# Altium schematic sheet Slave2_flying_pcb_v1.SchDoc
size A4
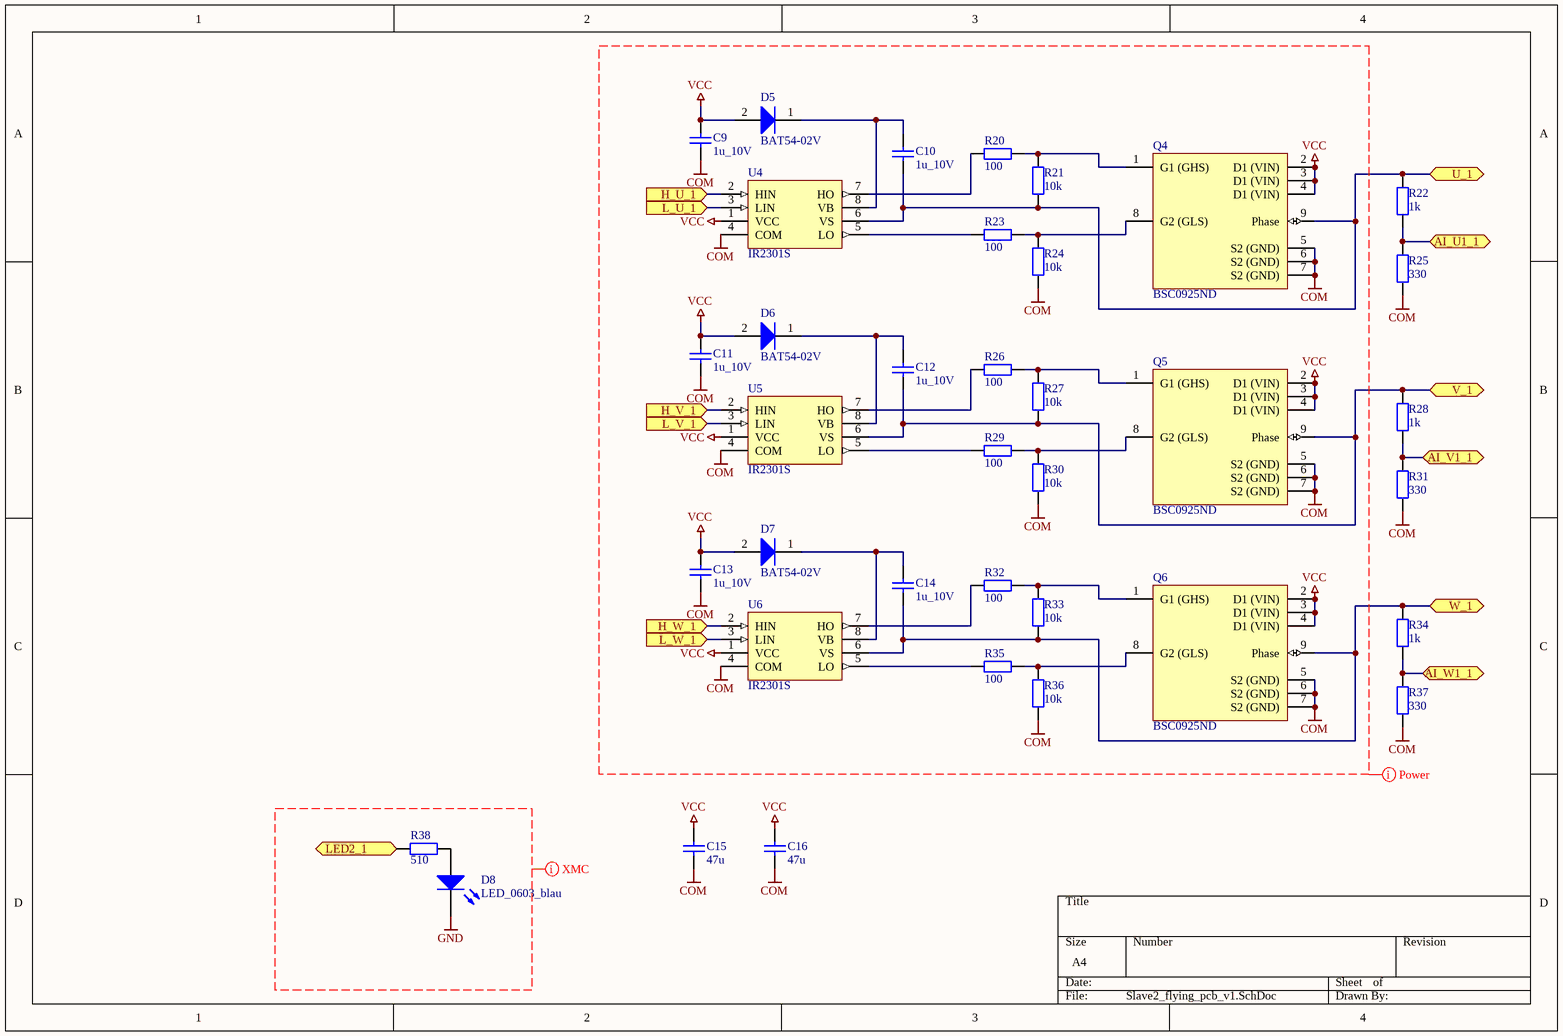
[diagram p0: Slave2_flying_pcb_v1.SchDoc]

## Parts
C9  1u_10V  [1608[0603]]
C10  1u_10V  [1608[0603]]
C11  1u_10V  [1608[0603]]
C12  1u_10V  [1608[0603]]
C13  1u_10V  [1608[0603]]
C14  1u_10V  [1608[0603]]
C15  47u  [_0805]
C16  47u  [_0805]
D5  BAT54-02V  [INF-SC79_V]
D6  BAT54-02V  [INF-SC79_V]
D7  BAT54-02V  [INF-SC79_V]
D8  LED_0603_blau  [LED_0603]
Q4  BSC0925ND  [INF-PG-TISON-8_V]
Q5  BSC0925ND  [INF-PG-TISON-8_V]
Q6  BSC0925ND  [INF-PG-TISON-8_V]
R20  value 100  [1608[0603]]  (hidden comment: Res_0603)
R21  value 10k  [1608[0603]]  (hidden comment: Res_0603)
R22  value 1k  [1608[0603]]  (hidden comment: Res_0603)
R23  value 100  [1608[0603]]  (hidden comment: Res_0603)
R24  value 10k  [1608[0603]]  (hidden comment: Res_0603)
R25  value 330  [1608[0603]]  (hidden comment: Res_0603)
R26  value 100  [1608[0603]]  (hidden comment: Res_0603)
R27  value 10k  [1608[0603]]  (hidden comment: Res_0603)
R28  value 1k  [1608[0603]]  (hidden comment: Res_0603)
R29  value 100  [1608[0603]]  (hidden comment: Res_0603)
R30  value 10k  [1608[0603]]  (hidden comment: Res_0603)
R31  value 330  [1608[0603]]  (hidden comment: Res_0603)
R32  value 100  [1608[0603]]  (hidden comment: Res_0603)
R33  value 10k  [1608[0603]]  (hidden comment: Res_0603)
R34  value 1k  [1608[0603]]  (hidden comment: Res_0603)
R35  value 100  [1608[0603]]  (hidden comment: Res_0603)
R36  value 10k  [1608[0603]]  (hidden comment: Res_0603)
R37  value 330  [1608[0603]]  (hidden comment: Res_0603)
R38  value 510  [1608[0603]]  (hidden comment: Res_0603)
U4  IR2301S  [SO-8_N]
U5  IR2301S  [SO-8_N]
U6  IR2301S  [SO-8_N]

## Ports
AI_U1_1 (bidir), AI_V1_1 (bidir), AI_W1_1 (bidir), H_U_1, H_V_1, H_W_1, L_U_1, L_V_1, L_W_1, LED2_1, U_1 (bidir), V_1 (bidir), W_1 (bidir)

## Nets
COM: C9.2 C11.2 C13.2 C15.1 C16.1 Q4.5(S2_(GND)) Q4.6(S2_(GND)) Q4.7(S2_(GND)) Q5.5(S2_(GND)) Q5.6(S2_(GND)) Q5.7(S2_(GND)) Q6.5(S2_(GND)) Q6.6(S2_(GND)) Q6.7(S2_(GND)) R24.2 R25.2 R30.2 R31.2 R36.2 R37.2 U4.4(COM) U5.4(COM) U6.4(COM)
GND: D8.2
VCC: C9.1 C11.1 C13.1 C15.2 C16.2 D5.2(A) D6.2(A) D7.2(A) Q4.2(D1_(VIN)) Q4.3(D1_(VIN)) Q4.4(D1_(VIN)) Q5.2(D1_(VIN)) Q5.3(D1_(VIN)) Q5.4(D1_(VIN)) Q6.2(D1_(VIN)) Q6.3(D1_(VIN)) Q6.4(D1_(VIN)) U4.1(VCC) U5.1(VCC) U6.1(VCC)
AI_U1_1: R22.2 R25.1 ; port AI_U1_1
AI_V1_1: R28.2 R31.1 ; port AI_V1_1
AI_W1_1: R34.2 R37.1 ; port AI_W1_1
H_U_1: U4.2(HIN) ; port H_U_1
H_V_1: U5.2(HIN) ; port H_V_1
H_W_1: U6.2(HIN) ; port H_W_1
L_U_1: U4.3(LIN) ; port L_U_1
L_V_1: U5.3(LIN) ; port L_V_1
L_W_1: U6.3(LIN) ; port L_W_1
LED2_1: R38.1 ; port LED2_1
U_1: C10.2 Q4.9(Phase) R21.2 R22.1 U4.6(VS) ; port U_1
V_1: C12.2 Q5.9(Phase) R27.2 R28.1 U5.6(VS) ; port V_1
W_1: C14.2 Q6.9(Phase) R33.2 R34.1 U6.6(VS) ; port W_1
NetC10_1: C10.1 D5.1(K) U4.8(VB)
NetC12_1: C12.1 D6.1(K) U5.8(VB)
NetC14_1: C14.1 D7.1(K) U6.8(VB)
NetD8_1: D8.1 R38.2
NetQ4_1: Q4.1(G1_(GHS)) R20.1 R21.1
NetQ4_8: Q4.8(G2_(GLS)) R23.1 R24.1
NetQ5_1: Q5.1(G1_(GHS)) R26.1 R27.1
NetQ5_8: Q5.8(G2_(GLS)) R29.1 R30.1
NetQ6_1: Q6.1(G1_(GHS)) R32.1 R33.1
NetQ6_8: Q6.8(G2_(GLS)) R35.1 R36.1
NetR20_2: R20.2 U4.7(HO)
NetR23_2: R23.2 U4.5(LO)
NetR26_2: R26.2 U5.7(HO)
NetR29_2: R29.2 U5.5(LO)
NetR32_2: R32.2 U6.7(HO)
NetR35_2: R35.2 U6.5(LO)

## Layout directives
net class Power: COM, VCC
net class XMC: GND

## Library data of the parts
C9-C14 = Cap_133: RS_number: 788-2884; QR: 0; Capacity: 1u; Voltage: 10V; UID: Cap_133; Name: 1u_10V; Name_Hyperlink: http://at.rs-online.com/web/p/keramik-multilayer-kondensatoren/7882884; ComponentLink1URL: #NAME?; mounting: SMD
C15 C16 = Cap_133: Name: Cap_cer_1u_50V; Capacity: 1u; Voltage: 50V; RS_number: 723-6350; QR: 0; UID: Cap_133; ComponentLink1URL: #NAME?; mounting: SMD; Name_Hyperlink: http://at.rs-online.com/web/p/keramik-multilayer-kondensatoren/7236350/
D5-D7 = BAT54-02V: Silicon Schottky Diode, SC79, Reel, Green; Manufacturer: Infineon; Green: TRUE; PackageReference: SC79; PackageDescription: 2-Pin Semiconductor Package, 0.8 x 1.2 mm Body; Supplier 1: Mouser; Supplier Part Number 1: N/A; Halogen-free: FALSE; Mounting Technology: Surface Mount; PartNumber: BAT54-02V; ComponentLink1Description: Manufacturer URL; ComponentLink1URL: http://www.infineon.com/; ComponentLink2Description: Datasheet; ComponentLink2URL: http://www.infineon.com/dgdl/bat54series.pdf?folderId=db3a30431400ef68011425f1ca2505e3&fileId=db3a304314dca3890115190b74210ea6; ComponentLink3Description: Package Specification; ComponentLink3URL: http://www.infineon.com/dgdl/SC79-Package_Overview.pdf?folderId=db3a30431936bc4b011951fbddb03b15&fileId=db3a30431936bc4b01195226fe583b41
D8 = DIODE_60: Type: LED; Colour: blau; RS_number: 697-3610P; QR: 0; UID: DIODE_60; Name: LED_0603_blau; Name_Hyperlink: http://at.rs-online.com/web/p/products/6973610P/; ComponentLink1URL: #WERT!; mounting: SMD
Q4-Q6 = BSC0925ND: N-Channel OptiMOS Power-MOSFET, 30 V VDS, 40 A ID, -55 to 150 degC, PG-TISON-8, Reel, Green; Manufacturer: Infineon; Green: TRUE; ID (max): 40 A; IDpuls (max): 160 A; Polarity: N; Ptot (max): 30 W; QG: 6.7 nC; RDS (on) (max): 5 mOhm; RDS (on) (max) (@4.5V): 7 mOhm; Rth: 4.2 K/W; RthJA (max): 125 K/W; VDS (max): 30 V; VGS(th) (max): 2 V; VGS(th) (min): 1.2 V; DatasheetVersion: Rev. 1.0; PackageVersion: Rev. 01, 09/2011; PackageReference: PG-TISON-8; PackageDescription: 8-Pin Plastic (Green) Small Outline Non-Leaded Package, 5 x 6 mm Body, 1.27 mm Pitch; Halogen-free: TRUE; Packing: Reel; RthJC (max): 4.2 K/W; Mounting Technology: Surface Mount; PartNumber: BSC0925ND; ComponentLink1Description: Manufacturer URL; ComponentLink1URL: http://www.infineon.com/; ComponentLink2Description: Datasheet; ComponentLink2URL: http://www.infineon.com/dgdl/BSC0925ND_rev1+0.pdf?folderId=db3a304313b8b5a60113cee8763b02d7&fileId=db3a304336ca04c90136cec562a24914; ComponentLink3Description: Package Specification; ComponentLink3URL: http://www.infineon.com/dgdl/BSC0910NDI_Rev. 0.5.pdf?folderId=db3a304313b8b5a60113cee8763b02d7&fileId=db3a304336ca04c90136cedc08b64926
R20-R38 = Res_6: UID: Res_6; Name: Res_0603; ComponentLink1URL: #NAME?; mounting: SMD
U4-U6 = IR2101S: High and Low Side Driver; Published: 8-Jun-2000; LatestRevisionDate: 13-Apr-2006; LatestRevisionNote: IPC-7351 Footprint Added.; DatasheetVersion: PD60043J; PackageVersion: Feb-2001; PackageReference: SO-8; Publisher: Altium Limited; PackageDescription: 8-Pin Plastic Small Outline Integrated Circuit 1.27 mm Pitch; Code_JEDEC: MS-012-AA; Code_IPC: SOIC127P600-8; ComponentLink1Description: Manufacturer Link; ComponentLink1URL: http://www.irf.com/